# Altium project LHC.PrjPCB
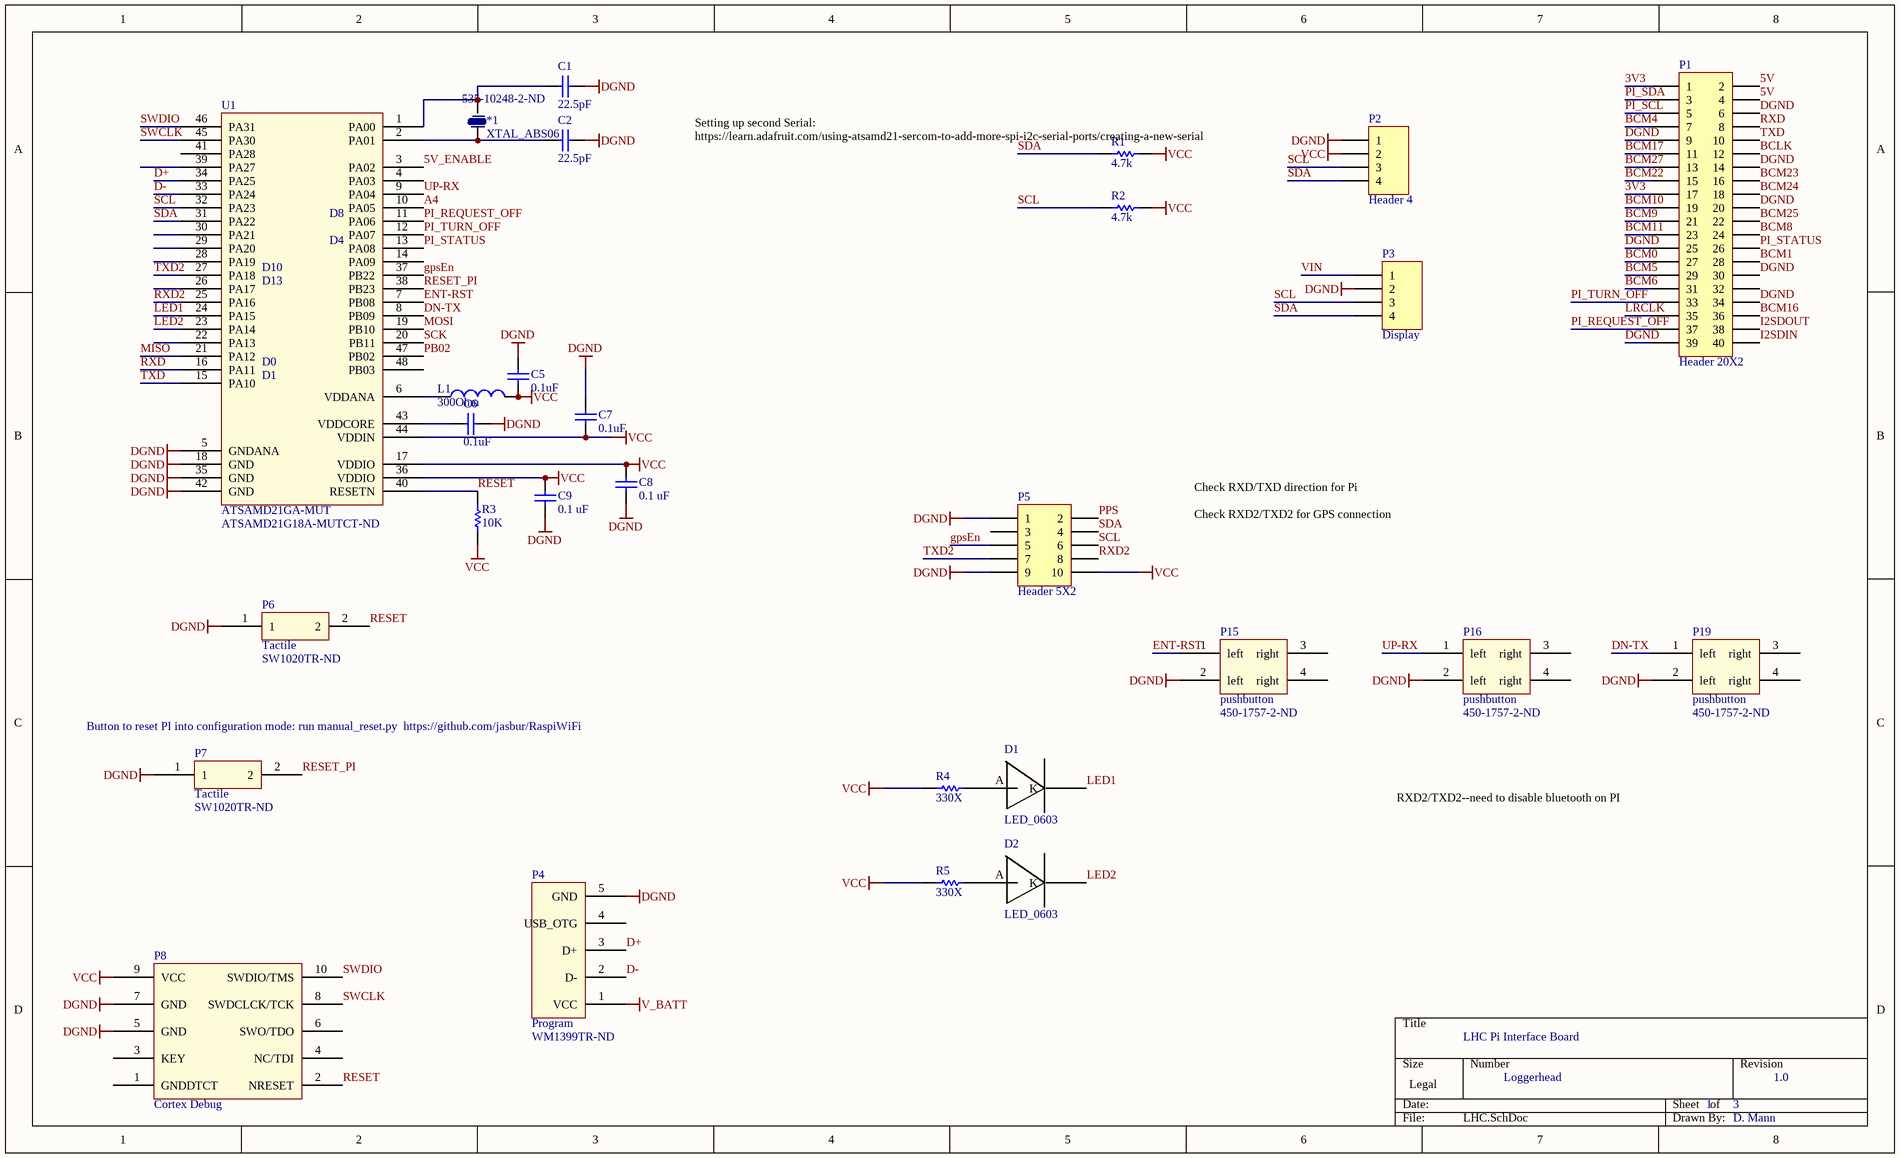
[diagram p0: LHC.SchDoc]
3 sheets, 82 parts. Net scope: global (net labels, ports and power ports of the same name join across sheets).
Board file: LHC.PcbDoc
Sheets:
  LHC.SchDoc
  LHC_audio.SchDoc
  LHC_Power.SchDoc

## Sheet LHC.SchDoc
size Legal

### Parts
*1  XTAL_ABS06  Supplier Part Number 1: 535-10248-2-ND  [XTAL-ABS06]
C1  22.5pF  [0402]
C2  22.5pF  [0402]
C5  0.1uF  [0402]
C6  0.1uF  [0402]
C7  0.1uF  [0402]
C8  0.1 uF  [0402]
C9  0.1 uF  [0402]
D1  LED_0603  [Diode0603]
D2  LED_0603  [Diode0603]
L1  300Ohm  [0805 (M2125) Ferrite]
P1  Header 20X2  [HDR2X20]
P2  Header 4  [HDR1X4]
P3  Display  [HDR1X4]
P4  Program  Supplier Part Number 1: WM1399TR-ND  [microUSB-B]
P5  Header 5X2  [HDR2X5]
P6  Tactile  Supplier Part Number 1: SW1020TR-ND  [Tactile-B3U-1000]
P7  Tactile  Supplier Part Number 1: SW1020TR-ND  [Tactile-B3U-1000]
P8  Cortex Debug  [Header_2x5_50mil]
P15  pushbutton  Supplier Part Number 1: 450-1757-2-ND  [SOP4]
P16  pushbutton  Supplier Part Number 1: 450-1757-2-ND  [SOP4]
P19  pushbutton  Supplier Part Number 1: 450-1757-2-ND  [SOP4]
R1  4.7k  [3-0603]
R2  4.7k  [3-0603]
R3  10K  [3-0603]
R4  330X  [3-0603]
R5  330X  [3-0603]
U1  ATSAMD21GA-MUT  Supplier Part Number 1: ATSAMD21G18A-MUTCT-ND  [QFN127P600-8N]

### Nets
DGND: C1.1 C2.1 C5.2 C6.2 C7.2 C8.2 C9.2 P1.6 P1.9 P1.14 P1.20 P1.25 P1.30 P1.34 P1.39 P2.1 P3.2 P4.5(GND) P5.1 P5.9 P6.1 P7.1 P8.5(GND) P8.7(GND) P15.2(left) P16.2(left) P19.2(left) U1.5(GNDANA) U1.18(GND) U1.35(GND) U1.42(GND)
V_BATT: P4.1(VCC)
VCC: C5.1 C7.1 C8.1 C9.1 L1.2 P2.2 P5.10 P8.9(VCC) R1.2 R2.2 R3.1 R4.1 R5.1 U1.17(VDDIO) U1.36(VDDIO) U1.44(VDDIN)
VIN: P3.1
3V3: P1.1 P1.17
5V: P1.2 P1.4
5V_ENABLE: U1.3(PA02)
A4: U1.10(PA05)
BCLK: P1.12
BCM0: P1.27
BCM1: P1.28
BCM4: P1.7
BCM5: P1.29
BCM6: P1.31
BCM8: P1.24
BCM9: P1.21
BCM10: P1.19
BCM11: P1.23
BCM16: P1.36
BCM17: P1.11
BCM22: P1.15
BCM23: P1.16
BCM24: P1.18
BCM25: P1.22
BCM27: P1.13
D+: P4.3(D+) U1.34(PA25)
D-: P4.2(D-) U1.33(PA24)
DN-TX: P19.1(left) U1.8(PB09)
ENT-RST: P15.1(left) U1.7(PB08)
gpsEn: P5.5 U1.37(PB22)
I2SDIN: P1.40
I2SDOUT: P1.38
LED1: D1.K U1.24(PA15)
LED2: D2.K U1.23(PA14)
LRCLK: P1.35
MISO: U1.21(PA12)
MOSI: U1.19(PB10)
PB02: U1.47(PB02)
PI_REQUEST_OFF: P1.37 U1.11(PA06)
PI_SCL: P1.5
PI_SDA: P1.3
PI_STATUS: P1.26 U1.13(PA08)
PI_TURN_OFF: P1.33 U1.12(PA07)
PPS: P5.2
RESET: P6.2 P8.2(NRESET) R3.2 U1.40(RESETN)
RESET_PI: P7.2 U1.38(PB23)
RXD: P1.8 U1.16(PA11)
RXD2: P5.8 U1.25(PA16)
SCK: U1.20(PB11)
SCL: P2.3 P3.3 P5.6 R2.1 U1.32(PA23)
SDA: P2.4 P3.4 P5.4 R1.1 U1.31(PA22)
SWCLK: P8.8(SWDCLCK/TCK) U1.45(PA30)
SWDIO: P8.10(SWDIO/TMS) U1.46(PA31)
TXD: P1.10 U1.15(PA10)
TXD2: P5.7 U1.27(PA18)
UP-RX: P16.1(left) U1.9(PA04)
Net*1_1: *1.1 C2.2 U1.2(PA01)
Net*1_2: *1.2 C1.2 U1.1(PA00)
NetC6_1: C6.1 U1.43(VDDCORE)
NetD1_A: D1.A R4.2
NetD2_A: D2.A R5.2
NetL1_1: L1.1 U1.6(VDDANA)

Not connected (* = marked no-connect by the designer): P1 32; P4 4(USB_OTG); P5 3; P8 1(GNDDTCT) 3(KEY) 4(NC/TDI) 6(SWO/TDO); P15 3(right) 4(right); P16 3(right) 4(right); P19 3(right) 4(right); U1 4(PA03) 14(PA09) 22(PA13) 26(PA17) 28(PA19) 29(PA20) 30(PA21) 39(PA27) 41(PA28) 48(PB03)

### Notes on the sheet
- (near U1) D8
- (near U1) D10
- (near U1) D13
- (near U1) D4
- Setting up second Serial: https://learn.adafruit.com/using-atsamd21-sercom-to-add-more-spi-i2c-serial-ports/creating-a-new-serial
- (near U1) D0
- (near U1) D1
- Check RXD/TXD direction for Pi
  Check RXD2/TXD2 for GPS connection
- (near P7) Button to reset PI into configuration mode: run manual_reset.py  https://github.com/jasbur/RaspiWiFi
- RXD2/TXD2--need to disable bluetooth on PI
- LHC Pi Interface Board
- Loggerhead
- 1
- 3
- 1.0
- D. Mann

### Library data of the parts
C1 C2 = C0402: Ceramic Chip Capacitor - Standard; Note: Footprint corresponds to dimensions for bulk cassette packaging. This case size has tightened tolerances.; Value: 12.5; Published: 17-Jul-2002; LatestRevisionDate: 19-Mar-2004; LatestRevisionNote: Silkscreen size reduced.; DatasheetDocument: Mar-2001; PackageDocument: Mar-2001; PackageReference: 0402; Publisher: Altium Limited; Code_JEITA: 0402; Code_IPC: 1005 [0402]; ComponentLink1Description: Manufacturer Link; ComponentLink1URL: http://www.kemet.com/; ComponentLink2Description: Datasheet; ComponentLink2URL: http://www.kemet.com/kemet/web/homepage/kechome.nsf/vapubfilesname/F3102TA.pdf/$file/F3102TA.pdf
C5-C7 = C0402: Ceramic Chip Capacitor - Standard; Note: Footprint corresponds to dimensions for bulk cassette packaging. This case size has tightened tolerances.; Published: 17-Jul-2002; LatestRevisionDate: 19-Mar-2004; LatestRevisionNote: Silkscreen size reduced.; DatasheetDocument: Mar-2001; PackageDocument: Mar-2001; PackageReference: 0402; Publisher: Altium Limited; Code_JEITA: 0402; Code_IPC: 1005 [0402]; ComponentLink1Description: Manufacturer Link; ComponentLink1URL: http://www.kemet.com/; ComponentLink2Description: Datasheet; ComponentLink2URL: http://www.kemet.com/kemet/web/homepage/kechome.nsf/vapubfilesname/F3102TA.pdf/$file/F3102TA.pdf; Value: 0.1uF
C8 C9 = C0402: Ceramic Chip Capacitor - Standard; Note: Footprint corresponds to dimensions for bulk cassette packaging. This case size has tightened tolerances.; Value: 0.1uF; Published: 17-Jul-2002; LatestRevisionDate: 19-Mar-2004; LatestRevisionNote: Silkscreen size reduced.; DatasheetDocument: Mar-2001; PackageDocument: Mar-2001; PackageReference: 0402; Publisher: Altium Limited; Code_JEITA: 0402; Code_IPC: 1005 [0402]; ComponentLink1Description: Manufacturer Link; ComponentLink1URL: http://www.kemet.com/; ComponentLink2Description: Datasheet; ComponentLink2URL: http://www.kemet.com/kemet/web/homepage/kechome.nsf/vapubfilesname/F3102TA.pdf/$file/F3102TA.pdf
L1 = Ferrite 0805(M2125) 3A: Ferrite 25mOhm@DC,  60 Ohm@100MHz; Fabrication Tested: NO; Creator and Date: Design Engineer's Name; Footprint Verified By: *; Schematic Verified By: *; Vendor Info Verified By: *; Value: 300Ohm; HelpURL: http://www.yuden.co.jp/ut/product/pdf/mlci08_e.pdf; Mass (place origin at center): *; Supplier 1: Digi-Key; Supplier Part Number 1: 587-1932-1-ND; Supplier 2: Newark; Supplier Part Number 2: 73M9170
P1 = Header 20X2: Header, 20-Pin, Dual row; LatestRevisionDate: 17-Jul-2002; LatestRevisionNote: Re-released for DXP Platform.; Publisher: Altium Limited
P2 P3 = Header 4: Header, 4-Pin; LatestRevisionDate: 17-Jul-2002; LatestRevisionNote: Re-released for DXP Platform.; Publisher: Altium Limited
P4 = microUSB-B: Supplier 1: Digi-Key
P5 = Header 5X2: Header, 5-Pin, Dual row; LatestRevisionDate: 17-Jul-2002; LatestRevisionNote: Re-released for DXP Platform.; Publisher: Altium Limited
P6 P7 = Tactile_B3U-1000: Supplier 1: Digi-Key
P8 = CortexDebug
R1-R5 = ERJ3RK: Precision Thick Film Chip Resistor, 10 Ohm to 1M Ohm Range, 1% and 0.5% Tolerance, 0603 Size, 0.063 W; Published: 17-Dec-2003; LatestRevisionDate: 19-Mar-2004; LatestRevisionNote: Silkscreen size reduced.; PackageDocument: Mar-2003; PackageReference: 3-0603; Publisher: Altium Limited; Code_IPC: 1608 [0603]; ComponentLink1Description: Manufacturer Link; ComponentLink1URL: http://www.panasonic.com/industrial/components/resistive_products.htm; ComponentLink2Description: Datasheet; ComponentLink2URL: http://www.panasonic.com/industrial/components/pdf/AOA0000CE2.pdf
U1 = ATSAMD21G18: Supplier 1: Digi-Key
*1 = XTAL_ABS06: Supplier 1: Digi-Key
P15 P16 P19 = pushbutton: Supplier 1: Digi-Key

## Sheet LHC_audio.SchDoc
size A
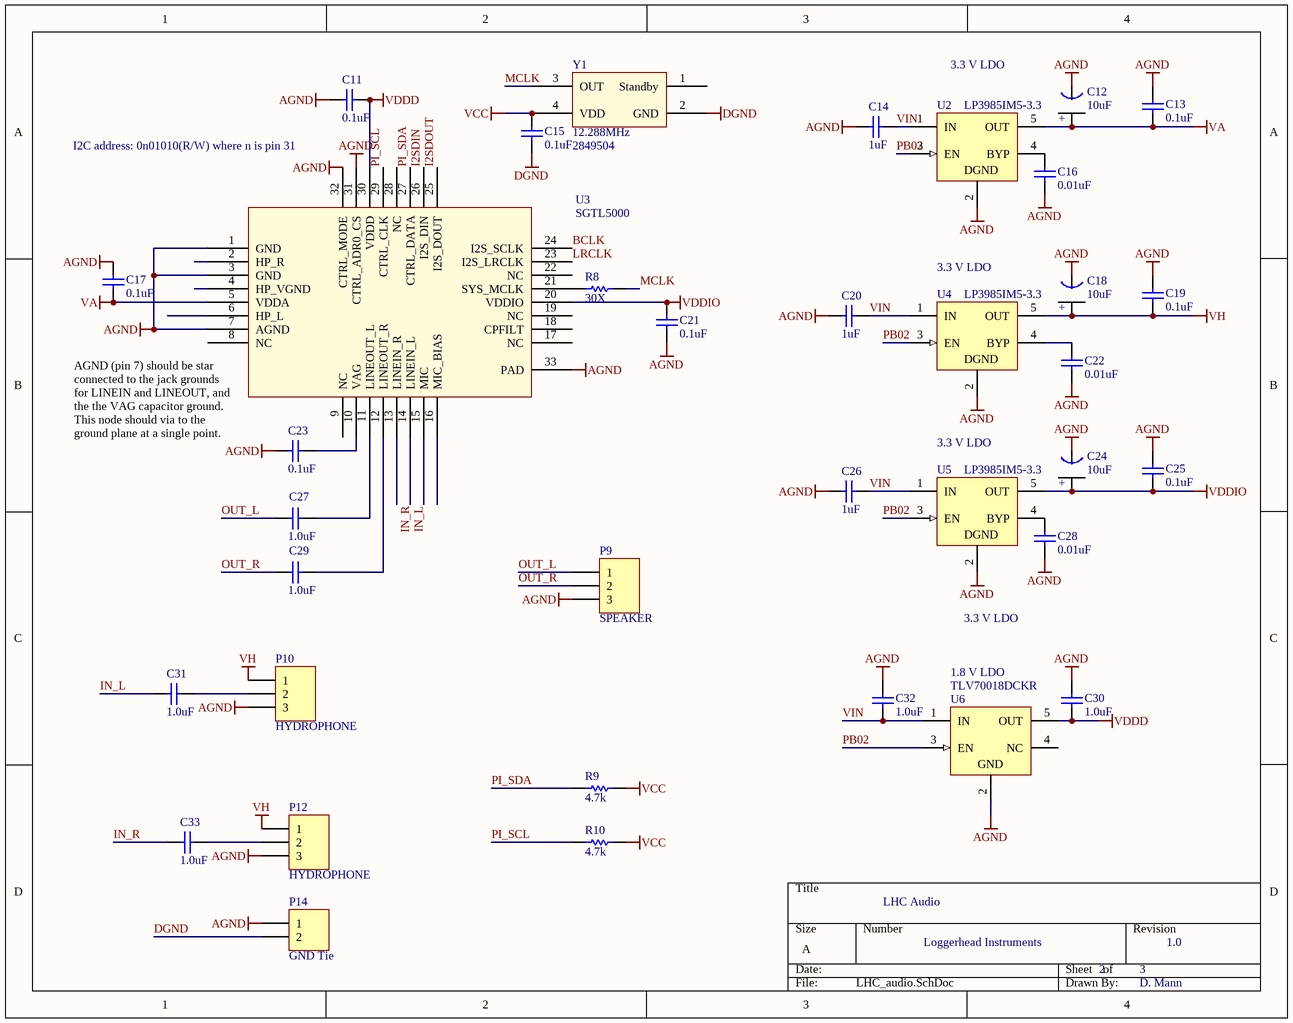
[diagram p1: LHC_audio.SchDoc]

### Parts
C11  0.1uF  [0402]
C12  10uF  [Tant0805]
C13  0.1uF  [0402]
C14  1uF  [0402]
C15  0.1uF  [0402]
C16  0.01uF  [0402]
C17  0.1uF  [0402]
C18  10uF  [Tant0805]
C19  0.1uF  [0402]
C20  1uF  [0402]
C21  0.1uF  [0402]
C22  0.01uF  [0402]
C23  0.1uF  [0402]
C24  10uF  [Tant0805]
C25  0.1uF  [0402]
C26  1uF  [0402]
C27  1.0uF  [0402]
C28  0.01uF  [0402]
C29  1.0uF  [0402]
C30  1.0uF  [0402]
C31  1.0uF  [0402]
C32  1.0uF  [0402]
C33  1.0uF  [0402]
P9  SPEAKER  [HDR1X3]
P10  HYDROPHONE  [HDR1X3]
P12  HYDROPHONE  [HDR1X3]
P14  GND Tie  [HDR1X2]
R8  30X  [3-0603]
R9  4.7k  [3-0603]
R10  4.7k  [3-0603]
U2  LP3985IM5-3.3  [MF05A_N]
U3  SGTL5000  [QFN32]
U4  LP3985IM5-3.3  [MF05A_N]
U5  LP3985IM5-3.3  [MF05A_N]
U6  TLV70018DCKR  [TI-DCK5_V]
Y1  12.288MHz  Supplier Part Number 1: 2849504  [Oscillator_5x3.2]

### Nets
AGND: C11.2 C12.1(GND) C13.2 C14.2 C16.2 C17.2 C18.1(GND) C19.2 C20.2 C21.2 C22.2 C23.2 C24.1(GND) C25.2 C26.2 C28.2 C30.2 C32.2 P9.3 P10.3 P12.3 P14.1 U2.2(GND) U3.1(GND) U3.3(GND) U3.7(AGND) U3.31(CTRL_ADR0_CS) U3.32(CTRL_MODE) U3.33(PAD) U4.2(GND) U5.2(GND) U6.2(GND)
DGND: C15.2 P14.2 Y1.2(GND)
VA: C12.2(+) C13.1 C17.1 U2.5(OUT) U3.5(VDDA)
VCC: C15.1 R9.2 R10.2 Y1.4(VDD)
VDDD: C11.1 C30.1 U3.30(VDDD) U6.5(OUT)
VDDIO: C21.1 C24.2(+) C25.1 U3.20(VDDIO) U5.5(OUT)
VH: C18.2(+) C19.1 P10.1 P12.1 U4.5(OUT)
VIN: C14.1 C20.1 C26.1 C32.1 U2.1(IN) U4.1(IN) U5.1(IN) U6.1(IN)
BCLK: U3.24(I2S_SCLK)
I2SDIN: U3.26(I2S_DIN)
I2SDOUT: U3.25(I2S_DOUT)
IN_L: C31.2 U3.14(LINEIN_L)
IN_R: C33.2 U3.13(LINEIN_R)
LRCLK: U3.23(I2S_LRCLK)
MCLK: R8.2 Y1.3(OUT)
OUT_L: C27.1 P9.1
OUT_R: C29.1 P9.2
PB02: U2.3(EN) U4.3(EN) U5.3(EN) U6.3(EN)
PI_SCL: R10.1 U3.29(CTRL_CLK)
PI_SDA: R9.1 U3.27(CTRL_DATA)
NetC16_1: C16.1 U2.4(BYP)
NetC22_1: C22.1 U4.4(BYP)
NetC23_1: C23.1 U3.10(VAG)
NetC27_2: C27.2 U3.11(LINEOUT_L)
NetC28_1: C28.1 U5.4(BYP)
NetC29_2: C29.2 U3.12(LINEOUT_R)
NetC31_1: C31.1 P10.2
NetC33_1: C33.1 P12.2
NetR8_1: R8.1 U3.21(SYS_MCLK)

Not connected (* = marked no-connect by the designer): U3 2(HP_R) 4(HP_VGND) 6(HP_L) 8(NC) 9(NC) 15(MIC) 16(MIC_BIAS) 17(NC) 18(CPFILT) 19(NC) 22(NC) 28(NC); U6 4(NC); Y1 1(Standby)

### Notes on the sheet
- 3.3 V LDO
- I2C address: 0n01010(R/W) where n is pin 31
- (near U4) 3.3 V LDO
- (near U3) AGND (pin 7) should be star connected to the jack grounds for LINEIN and LINEOUT, and the the VAG capacitor ground. This node should via to the ground plane at a single point.
- (near U5) 3.3 V LDO
- (near U6) 1.8 V LDO
- LHC Audio
- Loggerhead Instruments
- 2
- 3
- 1.0
- D. Mann
- (in symbol LP3985IM5-3.3) DGND

### Library data of the parts
C11 C13 C15 C17 C19 C21 C23 C25 = C0402: as C5 on sheet LHC; Published: 17-Jul-2002; LatestRevisionDate: 19-Mar-2004; LatestRevisionNote: Silkscreen size reduced.; DatasheetDocument: Mar-2001; PackageDocument: Mar-2001; PackageReference: 0402; Publisher: Altium Limited; Code_JEITA: 0402; Code_IPC: 1005 [0402]; ComponentLink1Description: Manufacturer Link; ComponentLink1URL: http://www.kemet.com/; ComponentLink2Description: Datasheet; ComponentLink2URL: http://www.kemet.com/kemet/web/homepage/kechome.nsf/vapubfilesname/F3102TA.pdf/$file/F3102TA.pdf; Value: 0.1uF
C12 C18 C24 = Tant0805: Value: 10uF
C14 C16 C20 C22 C26-C33 = C0402: as C8 on sheet LHC; Published: 17-Jul-2002; LatestRevisionDate: 19-Mar-2004; LatestRevisionNote: Silkscreen size reduced.; DatasheetDocument: Mar-2001; PackageDocument: Mar-2001; PackageReference: 0402; Publisher: Altium Limited; Code_JEITA: 0402; Code_IPC: 1005 [0402]; ComponentLink1Description: Manufacturer Link; ComponentLink1URL: http://www.kemet.com/; ComponentLink2Description: Datasheet; ComponentLink2URL: http://www.kemet.com/kemet/web/homepage/kechome.nsf/vapubfilesname/F3102TA.pdf/$file/F3102TA.pdf
P9 P10 P12 = Header 3: Header, 3-Pin; LatestRevisionDate: 17-Jul-2002; LatestRevisionNote: Re-released for DXP Platform.; Publisher: Altium Limited
P14 = Header 2: Header, 2-Pin; LatestRevisionDate: 17-Jul-2002; LatestRevisionNote: Re-released for DXP Platform.; Publisher: Altium Limited
R8-R10 = ERJ3RK: as R1 on sheet LHC; Published: 17-Dec-2003; LatestRevisionDate: 19-Mar-2004; LatestRevisionNote: Silkscreen size reduced.; PackageDocument: Mar-2003; PackageReference: 3-0603; Publisher: Altium Limited; Code_IPC: 1608 [0603]; ComponentLink1Description: Manufacturer Link; ComponentLink1URL: http://www.panasonic.com/industrial/components/resistive_products.htm; ComponentLink2Description: Datasheet; ComponentLink2URL: http://www.panasonic.com/industrial/components/pdf/AOA0000CE2.pdf
U2 U4 U5 = LP3985IM5-3.3: Micropower, 150mA Low-Noise Ultra Low-Dropout CMOS Voltage Regulator; Manufacturer: National Semiconductor; CompType: LDO IC; PackageTopMarking: LDQB*XTT; PowerWise: N; Published: 4-Dec-2008; DatasheetVersion: Aug-2005; PackageVersion: revD, Aug-2008; PackageReference: MF05A; Publisher: Altium Limited; PackageDescription: Molded SOT-23, .115 x .063 x .040 in Body, 5 Lead, .0375 in Pitch; PartNumber: LP3985IM5-3.3; RoHS: O; PinCount: 5; DigiKeyPartNumber: LP3985IM5-3.3CT-ND; ComponentLink1Description: LP3985 Datasheet; ComponentLink1URL: http://www.national.com/ds/LP/LP3985.pdf; ComponentLink2Description: LP3985 Web Page; ComponentLink2URL: http://www.national.com/pf/LP/LP3985.html; ComponentLink3Description: MF05A Package Page; ComponentLink3URL: http://www.national.com/packaging/folders/mf05a.html
U6 = TLV70018DCKR: Single Output LDO, 200 mA, Fixed 1.8 V Output, 2 to 5.5 V Input, with Low IQ, 5-pin SC70 (DCK), -40 to 125 degC, Green (RoHS & no Sb/Br); Manufacturer: Texas Instruments; Accuracy(%): 2; Fixed Output Options(V): 1.8; Iout(Max)(A): 0.2; Iq(Typ)(mA): 0.03; SubFamily: Single Channel LDO; Vdo(Typ)(mV): 175; Vin(Max)(V): 5.5; DatasheetVersion: SLVSA00D; PackageVersion: 4093553-3/G; PackageReference: DCK5; PackageDescription: 5-Pin Plastic Small-Outline, Body 2 x 1.25 mm, Pitch 0.65 mm; Supplier 1: Digi-Key; Supplier Part Number 1: 296-32409-2-ND; Supplier 2: Digi-Key; Supplier Part Number 2: 296-32409-1-ND; Supplier 3: Digi-Key; Supplier Part Number 3: 296-32409-6-ND; Supplier 4: Newark; Supplier Part Number 4: 55R7461; Supplier 5: Mouser; Supplier Part Number 5: 595-TLV70018DCKR; Eco-Plan: Green (RoHS & no Sb/Br); Vin(Min)(V): 2; Vout Adj(Max)(V): 1.8; Vout Adj(Min)(V): 1.8; Mounting Technology: Surface Mount; Code_JEDEC: MO-203; PartNumber: TLV70018DCKR; ComponentLink1Description: Manufacturer URL; ComponentLink1URL: http://www.ti.com/; ComponentLink2Description: Datasheet; ComponentLink2URL: http://www.ti.com/general/docs/lit/getliterature.tsp?genericPartNumber=TLV70018&fileType=pdf; ComponentLink3Description: Package Specification; ComponentLink3URL: http://www.ti.com/litv/pdf/mpds025f
Y1 = Oscillator_5x3.2: Supplier 1: Farnell; Oscillator: 12.288MHz

## Sheet LHC_Power.SchDoc
size A
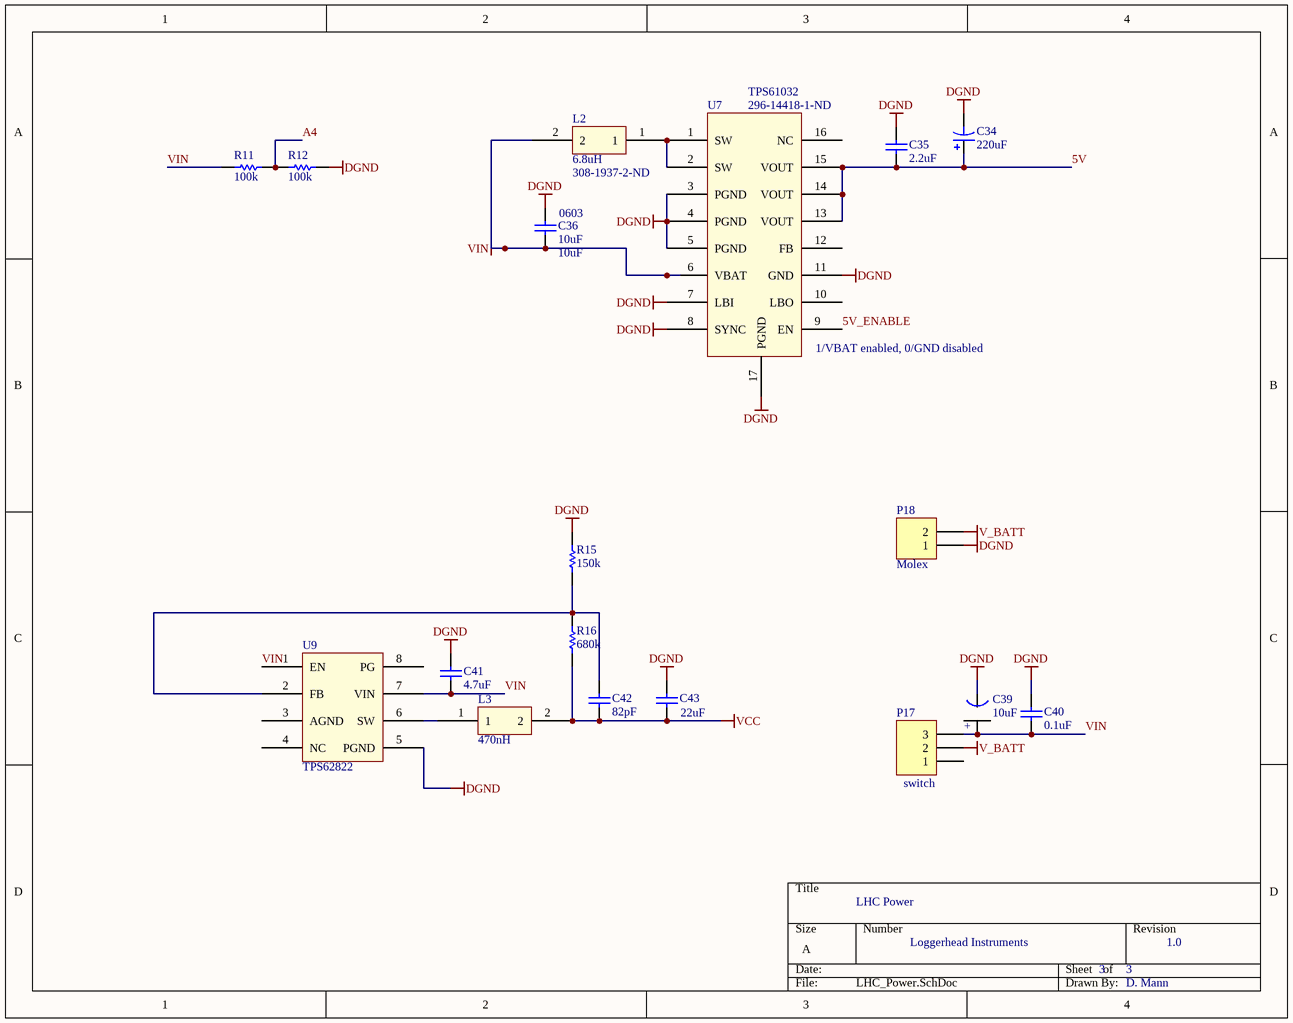
[diagram p2: LHC_Power.SchDoc]

### Parts
C34  220uF  [X]
C35  2.2uF  [0402]
C36  10uF  [0603]
C39  10uF  [Tant0805]
C40  0.1uF  [0402]
C41  4.7uF  [0603]
C42  82pF  [0402]
C43  22uF  [0603]
L2  6.8uH  Supplier Part Number 1: 308-1937-2-ND  [Inductor - duplicate]
L3  470nH  [Inductor_470NH]
P17  switch  [HDR1X3]
P18  Molex  [HDR1X2]
R11  100k  [3-0603]
R12  100k  [3-0603]
R15  150k  [3-0603]
R16  680k  [3-0603]
U7  TPS61032  Supplier Part Number 2: 296-14418-1-ND  [TPS6103x]
U9  TPS62822  [TPS62822_SOP8]

### Nets
DGND: C34.2 C35.2 C36.1 C39.1(GND) C40.2 C41.1 C43.1 P18.1 R12.1 R15.2 U7.3(PGND) U7.4(PGND) U7.5(PGND) U7.7(LBI) U7.8(SYNC) U7.11(GND) U7.17(PGND) U9.5(PGND)
V_BATT: P17.2 P18.2
VCC: C42.1 C43.2 L3.2 R16.1
VIN: C36.2 C39.2(+) C40.1 C41.2 L2.2 P17.3 R11.2 U7.6(VBAT) U9.1(EN) U9.7(VIN)
5V: C34.1 C35.1 U7.13(VOUT) U7.14(VOUT) U7.15(VOUT)
5V_ENABLE: U7.9(EN)
A4: R11.1 R12.2
NetC42_2: C42.2 R15.1 R16.2 U9.2(FB)
NetL2_1: L2.1 U7.1(SW) U7.2(SW)
NetL3_1: L3.1 U9.6(SW)

Not connected (* = marked no-connect by the designer): P17 1; U7 10(LBO) 12(FB) 16(NC); U9 3(AGND) 4(NC) 8(PG)

### Notes on the sheet
- (near U7) 1/VBAT enabled, 0/GND disabled
- LHC Power
- Loggerhead Instruments
- 3
- 1.0
- D. Mann

### Library data of the parts
C34 = T495X: Solid Tantalum Chip Capacitor, Standard T495 Series - Low ESR, Surge Robust; PCB_Layout: Round Glue Pad at 2.9 ±0.1mm in diameter at KEMET's option; Published: 17-Jul-2002; LatestRevisionDate: 19-Mar-2004; LatestRevisionNote: Silkscreen dimensions re-sized.; DatasheetDocument: Mar-2001; PackageDocument: Mar-2001; PackageReference: X; Publisher: Altium Limited; Code_JEITA: 7343-43; ComponentLink1Description: Manufacturer Link; ComponentLink1URL: http://www.kemet.com/; ComponentLink2Description: Datasheet; ComponentLink2URL: http://www.kemet.com/kemet/web/homepage/kechome.nsf/vapubfilesname/F3102TA.pdf/$file/F3102TA.pdf; Value: 220uF
C35 C40 = C0402: as C5 on sheet LHC; Published: 17-Jul-2002; LatestRevisionDate: 19-Mar-2004; LatestRevisionNote: Silkscreen size reduced.; DatasheetDocument: Mar-2001; PackageDocument: Mar-2001; PackageReference: 0402; Publisher: Altium Limited; Code_JEITA: 0402; Code_IPC: 1005 [0402]; ComponentLink1Description: Manufacturer Link; ComponentLink1URL: http://www.kemet.com/; ComponentLink2Description: Datasheet; ComponentLink2URL: http://www.kemet.com/kemet/web/homepage/kechome.nsf/vapubfilesname/F3102TA.pdf/$file/F3102TA.pdf
  C35: Value: 2.2uF
  C40: Value: 0.1uF
C36 = C0603: Ceramic Chip Capacitor - 0603; Note: Footprint corresponds to dimensions for bulk cassette packaging. This case size has tightened tolerances.; Published: 17-Jul-2002; LatestRevisionDate: 19-Mar-2004; LatestRevisionNote: Silkscreen size reduced.; DatasheetDocument: Mar-2001; PackageDocument: Mar-2001; PackageReference: 0603; Publisher: Altium Limited; Code_JEITA: 0603; Code_IPC: 1608 [0603]; ComponentLink1Description: Manufacturer Link; ComponentLink1URL: http://www.kemet.com/; ComponentLink2Description: Datasheet; ComponentLink2URL: http://www.kemet.com/kemet/web/homepage/kechome.nsf/vapubfilesname/F3102TA.pdf/$file/F3102TA.pdf; Value: 10uF
C39 = Tant0805: Value: 10uF
C41 = C0603: Ceramic Chip Capacitor - Standard; Note: Footprint corresponds to dimensions for bulk cassette packaging. This case size has tightened tolerances.; Published: 17-Jul-2002; LatestRevisionDate: 19-Mar-2004; LatestRevisionNote: Silkscreen size reduced.; DatasheetDocument: Mar-2001; PackageDocument: Mar-2001; PackageReference: 0603; Publisher: Altium Limited; Code_JEITA: 0603; Code_IPC: 1608 [0603]; ComponentLink1Description: Manufacturer Link; ComponentLink1URL: http://www.kemet.com/; ComponentLink2Description: Datasheet; ComponentLink2URL: http://www.kemet.com/kemet/web/homepage/kechome.nsf/vapubfilesname/F3102TA.pdf/$file/F3102TA.pdf; Value: 4.7uF
C42 = C0402: as C8 on sheet LHC; Published: 17-Jul-2002; LatestRevisionDate: 19-Mar-2004; LatestRevisionNote: Silkscreen size reduced.; DatasheetDocument: Mar-2001; PackageDocument: Mar-2001; PackageReference: 0402; Publisher: Altium Limited; Code_JEITA: 0402; Code_IPC: 1005 [0402]; ComponentLink1Description: Manufacturer Link; ComponentLink1URL: http://www.kemet.com/; ComponentLink2Description: Datasheet; ComponentLink2URL: http://www.kemet.com/kemet/web/homepage/kechome.nsf/vapubfilesname/F3102TA.pdf/$file/F3102TA.pdf
C43 = C0603: Ceramic Chip Capacitor - Standard; Note: Footprint corresponds to dimensions for bulk cassette packaging. This case size has tightened tolerances.; Value: 4.7uF; Published: 17-Jul-2002; LatestRevisionDate: 19-Mar-2004; LatestRevisionNote: Silkscreen size reduced.; DatasheetDocument: Mar-2001; PackageDocument: Mar-2001; PackageReference: 0603; Publisher: Altium Limited; Code_JEITA: 0603; Code_IPC: 1608 [0603]; ComponentLink1Description: Manufacturer Link; ComponentLink1URL: http://www.kemet.com/; ComponentLink2Description: Datasheet; ComponentLink2URL: http://www.kemet.com/kemet/web/homepage/kechome.nsf/vapubfilesname/F3102TA.pdf/$file/F3102TA.pdf
L2 = Inductor 6.8uH: Sumida Inductor; Supplier 1: Digi-Key
L3 = Inductor_470NH: Supplier 1: Newark; Supplier Part Number 1: 27T2304
P17 = Header 3: Header, 3-Pin; LatestRevisionDate: 17-Jul-2002; LatestRevisionNote: Re-released for DXP Platform.; Publisher: Altium Limited
P18 = Header 2: Header, 2-Pin; LatestRevisionDate: 17-Jul-2002; LatestRevisionNote: Re-released for DXP Platform.; Publisher: Altium Limited
R11 R12 R15 R16 = ERJ3RK: as R1 on sheet LHC; Published: 17-Dec-2003; LatestRevisionDate: 19-Mar-2004; LatestRevisionNote: Silkscreen size reduced.; PackageDocument: Mar-2003; PackageReference: 3-0603; Publisher: Altium Limited; Code_IPC: 1608 [0603]; ComponentLink1Description: Manufacturer Link; ComponentLink1URL: http://www.panasonic.com/industrial/components/resistive_products.htm; ComponentLink2Description: Datasheet; ComponentLink2URL: http://www.panasonic.com/industrial/components/pdf/AOA0000CE2.pdf
U7 = TPS6103x: Boost converter; Supplier 1: Newark; Supplier 2: Digi-Key
U9 = TPS62822: Step-down converter; Supplier 1: Farnell; Supplier Part Number 1: 2894176

## Nets that join several sheets
DGND: LHC (31 pins), LHC_audio (C15.2 P14.2 Y1.2), LHC_Power (18 pins)
V_BATT: LHC (P4.1), LHC_Power (P17.2 P18.2)
VCC: LHC (16 pins), LHC_audio (C15.1 R9.2 R10.2 Y1.4), LHC_Power (C42.1 C43.2 L3.2 R16.1)
VIN: LHC (P3.1), LHC_audio (8 pins), LHC_Power (10 pins)
5V: LHC (P1.2 P1.4), LHC_Power (5 pins)
5V_ENABLE: LHC (U1.3), LHC_Power (U7.9)
A4: LHC (U1.10), LHC_Power (R11.1 R12.2)
BCLK: LHC (P1.12), LHC_audio (U3.24)
I2SDIN: LHC (P1.40), LHC_audio (U3.26)
I2SDOUT: LHC (P1.38), LHC_audio (U3.25)
LRCLK: LHC (P1.35), LHC_audio (U3.23)
PB02: LHC (U1.47), LHC_audio (U2.3 U4.3 U5.3 U6.3)
PI_SCL: LHC (P1.5), LHC_audio (R10.1 U3.29)
PI_SDA: LHC (P1.3), LHC_audio (R9.1 U3.27)